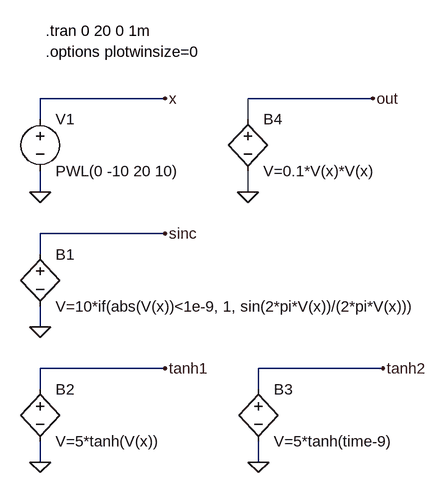
[diagram p0: schematic B_function.asc]
B_function.asc, the LTspice schematic file:
Version 4
SHEET 1 880 680
WIRE 16 64 -176 64
WIRE 336 64 144 64
WIRE -176 96 -176 64
WIRE 144 96 144 64
WIRE -176 208 -176 176
WIRE 144 208 144 176
WIRE 16 272 -176 272
WIRE -176 304 -176 272
WIRE -176 416 -176 384
WIRE 16 480 -176 480
WIRE 352 480 160 480
WIRE -176 512 -176 480
WIRE 160 512 160 480
WIRE -176 624 -176 592
WIRE 160 624 160 592
FLAG -176 208 0
FLAG 16 64 x
FLAG -176 416 0
FLAG 16 272 sinc
FLAG -176 624 0
FLAG 16 480 tanh1
FLAG 160 624 0
FLAG 352 480 tanh2
FLAG 144 208 0
FLAG 336 64 out
SYMBOL bv -176 288 R0
SYMATTR InstName B1
SYMATTR Value V=10*if(abs(V(x))<1e-9, 1, sin(2*pi*V(x))/(2*pi*V(x)))
SYMBOL voltage -176 80 R0
WINDOW 123 0 0 Left 0
WINDOW 39 0 0 Left 0
SYMATTR InstName V1
SYMATTR Value PWL(0 -10 20 10)
SYMBOL bv -176 496 R0
SYMATTR InstName B2
SYMATTR Value V=5*tanh(V(x))
SYMBOL bv 160 496 R0
SYMATTR InstName B3
SYMATTR Value V=5*tanh(time-9)
SYMBOL bv 144 80 R0
SYMATTR InstName B4
SYMATTR Value V=0.1*V(x)*V(x)
TEXT -168 -40 Left 0 !.tran 0 20 0 1m
TEXT -168 -8 Left 0 !.options plotwinsize=0

The netlist it stands for:
* B_function.asc
B1 sinc 0 V=10*if(abs(V(x))<1e-9, 1, sin(2*pi*V(x))/(2*pi*V(x)))
V1 x 0 PWL(0 -10 20 10)
B2 tanh1 0 V=5*tanh(V(x))
B3 tanh2 0 V=5*tanh(time-9)
B4 out 0 V=0.1*V(x)*V(x)
.tran 0 20 0 1m
.options plotwinsize=0
.backanno
.end